# EAGLE design SMD (EAGLE 8.2.0)
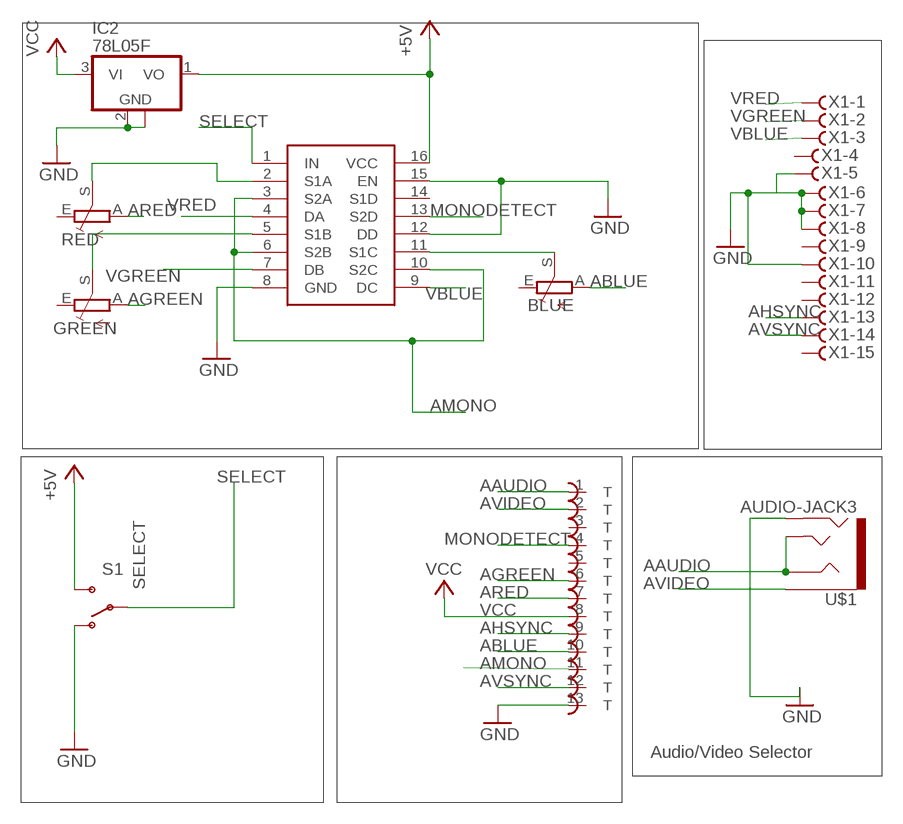
[diagram p0: schematic, sheet 1]

## Parts
ATARIOUT  DIN13T  [ADADS]
BLUE  TRIM_EU-CA6H  [CA6H]
GREEN  TRIM_EU-CA6H  [CA6H]
IC2  78L05F  [SOT89]
RED  TRIM_EU-CA6H  [CA6H]
S1  SWITCH-SPDT-SMD-A  [SWITCH-SPST-SMD-A]
TS5V330  V330  [SOIC16N]
U$1  AUDIO-JACK3  [AUDIO-JACK-TRRS-SMD]
X1  F15HDVS  [HDF15V]

## Nets
+5V: IC2.1(VO) S1.3(S) TS5V330.16(VCC)
AAUDIO: ATARIOUT.1 U$1.RING1 U$1.TIP
ABLUE: ATARIOUT.10 BLUE.A
AGREEN: ATARIOUT.6 GREEN.A
AHSYNC: ATARIOUT.9 X1.13
AMONO: ATARIOUT.11 TS5V330.3(S2A) TS5V330.6(S2B) TS5V330.10(S2C)
ARED: ATARIOUT.7 RED.A
AVIDEO: ATARIOUT.2 U$1.EARTH
AVSYNC: ATARIOUT.12 X1.14
BOUT: BLUE.S TS5V330.11(S1C)
GND: ATARIOUT.13 IC2.2(GND) IC2.2@1(GND) S1.1(O) TS5V330.8(GND) TS5V330.12(DD) TS5V330.15(EN) U$1.RING2 X1.5 X1.6 X1.7 X1.8 X1.10
GOUT: GREEN.S TS5V330.5(S1B)
MONODETECT: ATARIOUT.4 TS5V330.13(S2D)
ROUT: RED.S TS5V330.2(S1A)
SELECT: S1.2(P) TS5V330.1(IN)
VBLUE: TS5V330.9(DC) X1.3
VCC: ATARIOUT.8 IC2.3(VI)
VGREEN: TS5V330.7(DB) X1.2
VRED: TS5V330.4(DA) X1.1
Unconnected: ATARIOUT.3 ATARIOUT.5 BLUE.E GREEN.E RED.E TS5V330.14(S1D) X1.4 X1.9 X1.11 X1.12 X1.15

## Notes on the sheet
- Audio/Video Selector

## Library data of the parts
ATARIOUT = ube:DIN13
BLUE GREEN RED = pot:TRIM_EU-: POTENTIOMETER
IC2 = linear:78L*: POSITOIV-VOLTAGE REGULATORS Output up to 100 mA Source: Datasheet <http://focus.ti.com/lit/ds/symlink/ua78l05.pdf>
S1 = SparkFun-Electromechanical:SWITCH-SPDT: SPDT Switch Simple slide switch, Spark Fun Electronics SKU : COM-00102 DPDT SMT slide switch, AYZ0202, SWCH-08179; PROD_ID: SWCH-10651
TS5V330 = ube:V330
U$1 = SparkFun-Connectors:AUDIO-JACK3: Audio jack - 3.5mm TRRS variety - two rings.; PROD_ID: CONN-10676
X1 = con-subd:F15?S: SUB-D; OC_FARNELL: unknown; OC_NEWARK: unknown

## Net classes
0 default: width 0.254 mm

## Board
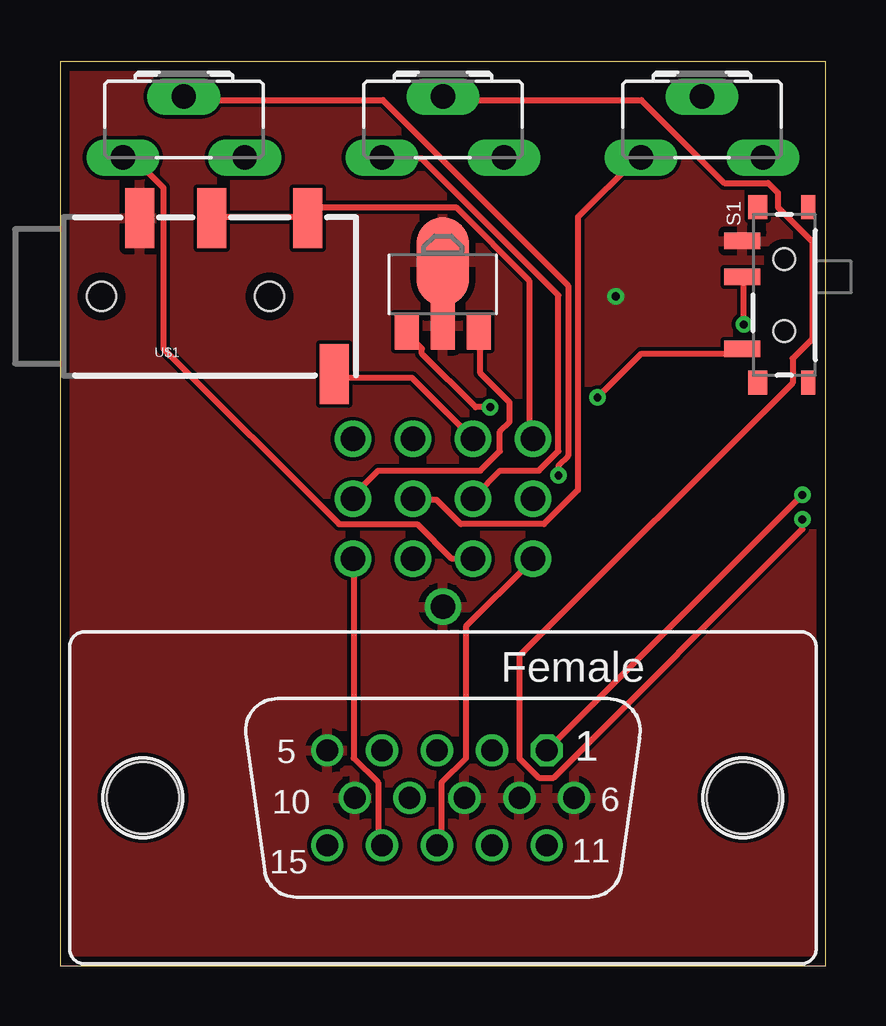
[diagram p1: board, top side]
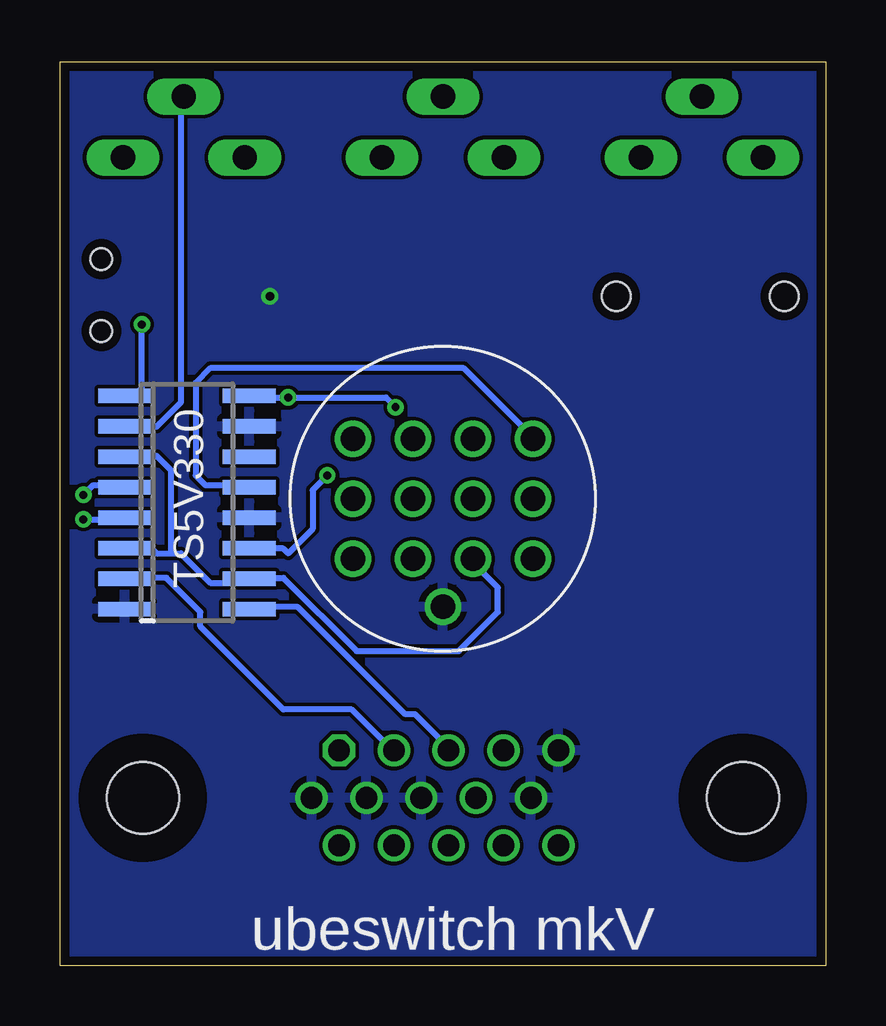
[diagram p2: board, bottom side, seen from below]

Size 31.9 x 37.7 mm. Coordinates in mm from the lower left corner, seen from the top.
Outline: 0,0 31.9,0 31.9,37.7 0,37.7 0,0
Copper layers (1*16): Top 0.0356mm / dielectric 1.5011mm / Bottom 0.0356mm
Design rules "PCBs_io": minimum track width 6mil, minimum drill 13mil, track to track 6mil, track to pad 6mil, pad to pad 6mil, via to via 6mil, smd to smd 6mil, copper to edge 15mil, drill to drill 6mil, minimum pad ring 7mil, minimum via ring 7mil, stop-mask expansion 3mil, vias tented up to drill 0mil, thermal gap 10mil

### Footprints (pad centres in the part's own frame; a part is rotated, then mirrored left to right if it is on the bottom)
ADADS = drill 1.016: 1 -3.75,2.5; 2 -1.25,2.5; 3 1.25,2.5; 4 3.75,2.5; 5 -3.75,0; 6 -1.25,0; 7 1.25,0; 8 3.75,0; 9 -3.75,-2.5; 10 -1.25,-2.5; 11 1.25,-2.5; 12 3.75,-2.5; 13 0,-4.5
CA6H = drill 1.016 long: A -2.54,0; E 2.54,0; S 0,2.54
SOT89 = smd 1 x 1.5: 1 -1.499,-1.981; 3 1.499,-1.981 | smd 1 x 2: 2 0,-1.727 | smd 2.2 x 3.7: 2@1 0,0.94
SWITCH-SPST-SMD-A = smd 0.7 x 1.5: 1 -2.25,-1.75; 2 -0.75,-1.75; 3 2.25,-1.75 | smd 1 x 0.6: GND1 -3.65,1; GND3 3.65,1 | smd 1 x 0.8: GND2 -3.65,-1.1; GND4 3.65,-1.1 | hole 0.9: -1.5,0; 1.5,0
SOIC16N = smd 0.6 x 2.2: 1 -4.445,-2.6; 2 -3.175,-2.6; 3 -1.905,-2.6; 4 -0.635,-2.6; 5 0.635,-2.6; 6 1.905,-2.6; 7 3.175,-2.6; 8 4.445,-2.6; 9 4.445,2.6; 10 3.175,2.6; 11 1.905,2.6; 12 0.635,2.6; 13 -0.635,2.6; 14 -1.905,2.6; 15 -3.175,2.6; 16 -4.445,2.6
AUDIO-JACK-TRRS-SMD = smd 1.2 x 2.5: EARTH 11.3,-3.25; RING1 6.2,3.25; RING2 3.2,3.25; TIP 10.2,3.25 | hole 1.2: 1.6,0; 8.6,0
HDF15V = drill 0.9 octagon: 1 4.329,1.98 | drill 0.9: 2 2.043,1.98; 3 -0.243,1.98; 4 -2.529,1.98; 5 -4.815,1.98; 6 5.472,0; 7 3.186,0; 8 0.9,0; 9 -1.386,0; 10 -3.672,0; 11 4.329,-1.98; 12 2.043,-1.98; 13 -0.243,-1.98; 14 -2.529,-1.98; 15 -4.815,-1.98 | hole 3: -12.5,0; 12.5,0

### Placement (x,y rotation side)
ATARIOUT  15.95,19.47 0 bottom
BLUE  5.16,33.7 0 top
GREEN  15.95,33.7 0 top
IC2  15.95,28.42 0 top
RED  26.75,33.7 0 top
S1  30.18,27.97 270 top
TS5V330  26.62,19.32 270 bottom
U$1  0.13,27.91 0 top
X1  15.95,7 0 top

### Tracks (layer width: path | path; a pad name or v marks a point on that pad's centre or on a via)
+5V  (via drill 0.33)
  Top 0.254: v17.93,23.29 17.32,23.29 15.08,25.52 15.08,25.73 14.47,26.34 IC2.1 | v22.4,23.69 24.22,25.52 28.29,25.52 S1.3
  Bottom 0.254: v17.93,23.29 18.33,23.69 v22.4,23.69 23.82,23.69 TS5V330.16
AAUDIO
  Top 0.254: U$1.RING1 6.34,31.21 10.2,31.21 U$1.TIP 10.41,31.21 10.81,31.62 16.5,31.62 19.55,28.57 19.55,22.07 ATARIOUT.1
ABLUE
  Top 0.254: ATARIOUT.10 17.11,16.99 16.3,16.99 14.88,18.41 11.63,18.41 4.31,25.73 4.31,32.43 3.09,33.65 2.69,33.65 BLUE.A
AGREEN
  Top 0.254: GREEN.A 13.45,33.65 15.08,33.65 20.77,27.96 20.77,21.46 19.96,20.65 18.33,20.65 17.32,19.63 ATARIOUT.6
AHSYNC
  Top 0.254: X1.13 15.89,5.2 15.89,7.64 16.91,8.66 16.91,14.14 19.55,16.79 ATARIOUT.9
AMONO
  Bottom 0.254: 27.27,17.19 27.88,17.19 28.09,17.39 29.1,17.39 TS5V330.6 | 27.27,17.19 26.87,17.19 25.65,15.97 24.02,15.97 TS5V330.10 23.82,16.18 22.6,16.18 19.55,13.13 15.28,13.13 13.66,14.75 13.66,15.77 14.67,16.79 ATARIOUT.11 | 27.27,17.19 27.27,20.65 27.88,21.25 29.1,21.25 TS5V330.3
ARED
  Top 0.254: ATARIOUT.7 14.88,19.43 15.69,19.43 16.71,18.41 20.16,18.41 21.58,19.83 21.58,31.21 24.02,33.65 RED.A
AVIDEO
  Top 0.254: U$1.EARTH 11.63,24.51 14.67,24.51 17.11,22.07 ATARIOUT.2
AVSYNC
  Top 0.254: X1.14 13.25,5.2 13.25,7.64 12.24,8.66 12.24,16.79 ATARIOUT.12
BOUT  (via drill 0.33)
  Top 0.254: v20.77,20.44 20.77,20.85 21.18,21.25 21.18,28.37 13.45,36.09 5.33,36.09 BLUE.S
  Bottom 0.254: v20.77,20.44 21.38,19.83 21.38,18.21 22.4,17.19 22.6,17.39 23.82,17.39 TS5V330.11
GND  (via drill 0.35)
  other vias: 23.16,27.91
  pour Bottom: 0.3,39.34 32.05,39.34 32.05,-0.03 0.3,-0.03
  pour Top: 0.3,-0.03 0.3,38.07 32.05,38.07 32.05,-0.03
GOUT  (via drill 0.33)
  Top 0.254: v30.93,18.61 30.93,18.21 20.57,7.84 19.96,7.84 19.14,8.66 19.14,12.92 30.52,24.3 30.52,25.32 31.34,26.13 31.34,30.2 29.91,31.62 29.91,32.23 29.51,32.63 27.68,32.63 24.22,36.09 16.1,36.09 GREEN.S
  Bottom 0.254: v30.93,18.61 29.3,18.61 TS5V330.5
MONODETECT
  Bottom 0.254: TS5V330.13 24.02,20.04 25.85,20.04 26.26,20.44 26.26,24.3 25.65,24.91 15.08,24.91 12.24,22.07 ATARIOUT.4
ROUT
  Bottom 0.254: TS5V330.2 29.1,22.47 27.88,22.47 26.87,23.49 26.87,36.09 RED.S
SELECT  (via drill 0.33)
  Top 0.254: v28.49,26.74 28.49,28.57 S1.2
  Bottom 0.254: v28.49,26.74 28.49,24.1 28.69,23.9 29.1,23.9 TS5V330.1
VBLUE
  Bottom 0.254: TS5V330.9 23.82,14.96 21.99,14.96 17.52,10.49 17.11,10.49 15.69,9.06 X1.3
VCC
  Top 0.254: IC2.3 17.52,26.34 17.52,24.71 18.74,23.49 18.74,22.68 18.33,22.27 18.33,21.46 17.52,20.65 13.25,20.65 12.24,19.63 ATARIOUT.8
VGREEN
  Bottom 0.254: TS5V330.7 29.1,16.18 27.48,16.18 26.05,14.75 26.05,14.14 22.6,10.69 19.75,10.69 18.13,9.06 X1.2
VRED  (via drill 0.33)
  Top 0.254: v30.93,19.63 20.36,9.06 X1.1
  Bottom 0.254: v30.93,19.63 30.52,20.04 29.3,20.04 TS5V330.4

### Text on the board
bNames: ubeswitch mkV
Document: Distance from PCB to surface. | Distance from PIN13 to bottom of case. | Distance from PIN13 to surface.